# EAGLE design Mini Differential IR Endstop by DC42 (EAGLE 7.5.0)
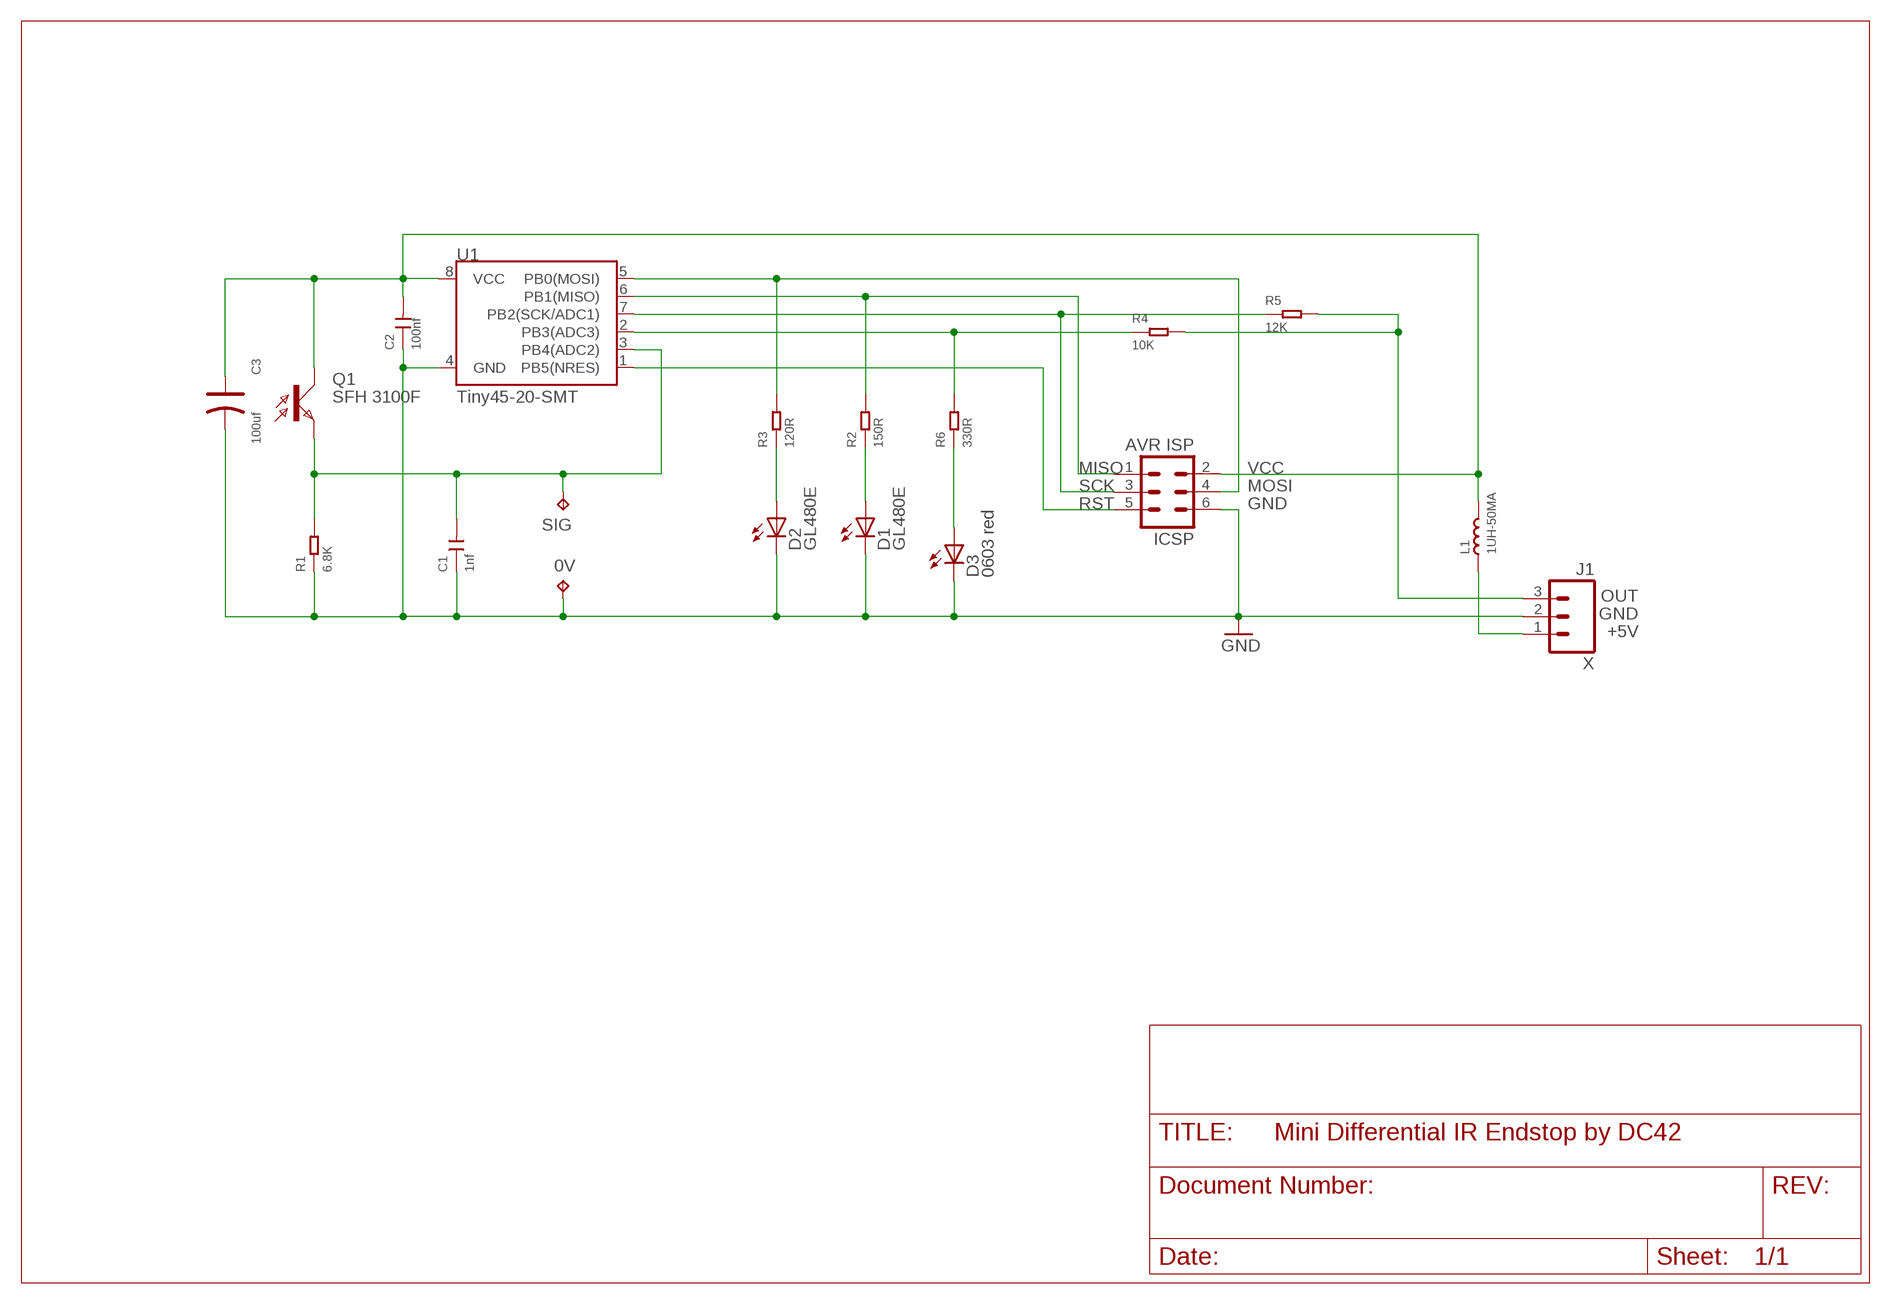
[diagram p0: schematic, sheet 1]

## Parts
0V  TPB1,27  [B1,27]
C1  1nf  CERAMIC-1NF-50V-5%-C0G(0603)  [C0603]
C2  100nf  CERAMIC-100NF-50V-10%-X7R(0603)  [C0603]
C3  100uf  DIP-ALUMINUM-100UF-16V(D5-H7MM)  [PC-D5.3MM]
D1  GL480E  LEDIRL80A  [IRL80A]
D2  GL480E  LEDIRL80A  [IRL80A]
D3  0603 red  LEDCHIP-LED0603  [CHIP-LED0603]
ICSP  AVR ISP  MA03-2  [MA03-2]
J1  X  M03LOCK  [1X03_LOCK]
L1  1UH-50MA  SMD-INDUCTOR-1UH-10%-50MA(0805)  [L0805]
Q1  SFH 3100F  SFH3100F  [SIDELOOKER]
R1  6.8K  SMD-RES-6.8K-1%-1/10W(0603)  [R0603]
R2  150R  SMD-RES-150R-1%-1/10W(0603)  [R0603]
R3  120R  SMD-RES-120R-1%-1/10W(0603)  [R0603]
R4  10K  SMD-RES-10K-1%-1/10W(0603)  [R0603]
R5  12K  SMD-RES-12K-1%-1/10W(0603)  [R0603]
R6  330R  SMD-RES-330R-1%-1/10W(0603)  [R0603]
SIG  TPB1,27  [B1,27]
U1  Tiny45-20-SMT  ATTINY45TINY45-20-SMT  [SO08-EIAJ]

## Nets
+5V: J1.1 L1.1
GND: 0V.TP C1.1 C2.1 C3.- D1.K(C) D2.K(C) D3.C ICSP.6 J1.2 R1.1 U1.4(GND)
MISO: ICSP.1 R2.2 U1.6(PB1(MISO))
MOSI: ICSP.4 R3.2 U1.5(PB0(MOSI))
N$2: R4.1 R6.2 U1.2(PB3(ADC3))
N$3: D1.A R2.1
N$5: D2.A R3.1
N$6: D3.A R6.1
N$14: C1.2 Q1.K(E) R1.2 SIG.TP U1.3(PB4(ADC2))
OUT: J1.3 R4.2 R5.2
RST: ICSP.5 U1.1(PB5(NRES))
SCK: ICSP.3 R5.1 U1.7(PB2(SCK/ADC1))
VCC: C2.2 C3.+ ICSP.2 L1.2 Q1.A(C) U1.8(VCC)

## Library data of the parts
0V SIG = testpad:TP: Test pad
C1 = Seeed-OPL-Capacitor:CERAMIC-1NF-50V-5%-C0G(0603): 302010341; MPN: GRM1885C1H102JA01D
C2 = Seeed-OPL-Capacitor:CERAMIC-100NF-50V-10%-X7R(0603): 302010138; MPN: CC0603KRX7R9BB104
C3 = Seeed-OPL-Capacitor:DIP-ALUMINUM-100UF-16V(D5-H7MM): 302030031
D1-D3 = led:LED: LED OSRAM: - CHIPLED LG R971, LG N971, LY N971, LG Q971, LY Q971, LO R971, LY R971 LH N974, LH R974 LS Q976, LO Q976, LY Q976 LO Q996 - Hyper CHIPLED LW Q18S LB Q993, LB Q99A, LB R99A - SideLED LS A670, LO A670, LY A670, LG A670, LP A670 LB A673, LV A673, LT A673, LW A673 LH A674 LY A675 LS A676, LA A676, LO A676, LY A676, LW A676 LS A679, LY A679, LG A679 - Hyper Micro SIDELED® LS Y876, LA Y876, LO Y876, LY Y876 LT Y87S - SmartLED LW L88C, LW L88S LB L89C, LB L89S, LG L890 LS L89K, LO L89K, LY L89K LS L896, LA L896, LO L896, LY L896 - TOPLED LS T670, LO T670, LY T670, LG T670, LP T670 LSG T670, LSP T670, LSY T670, LOP T670, LYG T670 LG T671, LOG T671, LSG T671 LB T673, LV T673, LT T673, LW T673 LH T674 LS T676, LA T676, LO T676, LY T676, LB T676, LH T676, LSB T676, LW T676 LB T67C, LV T67C, LT T67C, LS T67K, LO T67K, LY T67K, LW E67C LS E67B, LA E67B, LO E67B, LY E67B, LB E67C, LV E67C, LT E67C LW T67C LS T679, LY T679, LG T679 LS T770, LO T770, LY T770, LG T770, LP T770 LB T773, LV T773, LT T773, LW T773 LH T774 LS E675, LA E675, LY E675, LS T675 LS T776, LA T776, LO T776, LY T776, LB T776 LHGB T686 LT T68C, LB T68C - Hyper Mini TOPLED® LB M676 - Mini TOPLED Santana® LG M470 LS M47K, LO M47K, LY M47K Source: http://www.osram.convergy.de LUXEON: - LUMILED® LXK2-PW12-R00, LXK2-PW12-S00, LXK2-PW14-U00, LXK2-PW14-V00 LXK2-PM12-R00, LXK2-PM12-S00, LXK2-PM14-U00 LXK2-PE12-Q00, LXK2-PE12-R00, LXK2-PE12-S00, LXK2-PE14-T00, LXK2-PE14-U00 LXK2-PB12-K00, LXK2-PB12-L00, LXK2-PB12-M00, LXK2-PB14-N00, LXK2-PB14-P00, LXK2-PB14-Q00 LXK2-PR12-L00, LXK2-PR12-M00, LXK2-PR14-Q00, LXK2-PR14-R00 LXK2-PD12-Q00, LXK2-PD12-R00, LXK2-PD12-S00 LXK2-PH12-R00, LXK2-PH12-S00 LXK2-PL12-P00, LXK2-PL12-Q00, LXK2-PL12-R00 Source: www.luxeon.com KINGBRIGHT: KA-3528ASYC Source: www.kingbright.com
ICSP = con-lstb:MA03-2: PIN HEADER; OC_FARNELL: unknown; OC_NEWARK: unknown
J1 = SparkFun-Connectors:M03: Header 3 Standard 3-pin 0.1" header. Use with straight break away headers (SKU : PRT-00116), right angle break away headers (PRT-00553), swiss pins (PRT-00743), machine pins (PRT-00117), and female headers (PRT-00115). Molex polarized connector foot print use with SKU : PRT-08232 with associated crimp pins and housings.
L1 = Seeed-OPL-Inductor:SMD-INDUCTOR-1UH-10%-50MA(0805): 303010005; MPN: LQM21NN1R0K10
Q1 = osramSHF3100F:SFH3100F; MOUSER: 720-SFH3100F; OSRAM: SHF 3100F
R1 = Seeed-OPL-Resistor:SMD-RES-6.8K-1%-1/10W(0603): 301010198; MPN: RC0805JR-07220KL
R2 = Seeed-OPL-Resistor:SMD-RES-150R-1%-1/10W(0603): 301010188; MPN: RC0603FR-07150RL
R3 = Seeed-OPL-Resistor:SMD-RES-120R-1%-1/10W(0603): 301010194; MPN: RC0603FR-07120RL
R4 = Seeed-OPL-Resistor:SMD-RES-10K-1%-1/10W(0603): 301010299; MPN: RC0603FR-0710KL
R5 = Seeed-OPL-Resistor:SMD-RES-12K-1%-1/10W(0603): 301010102; MPN: RC0603FR-0712KL
R6 = Seeed-OPL-Resistor:SMD-RES-330R-1%-1/10W(0603): 301010300; MPN: RC0603FR-07330RL
U1 = SparkFun-DigitalIC:ATTINY45: Atmel 8-pin 2/4/8kB flash uC; PROD_ID: IC-08922

## Board
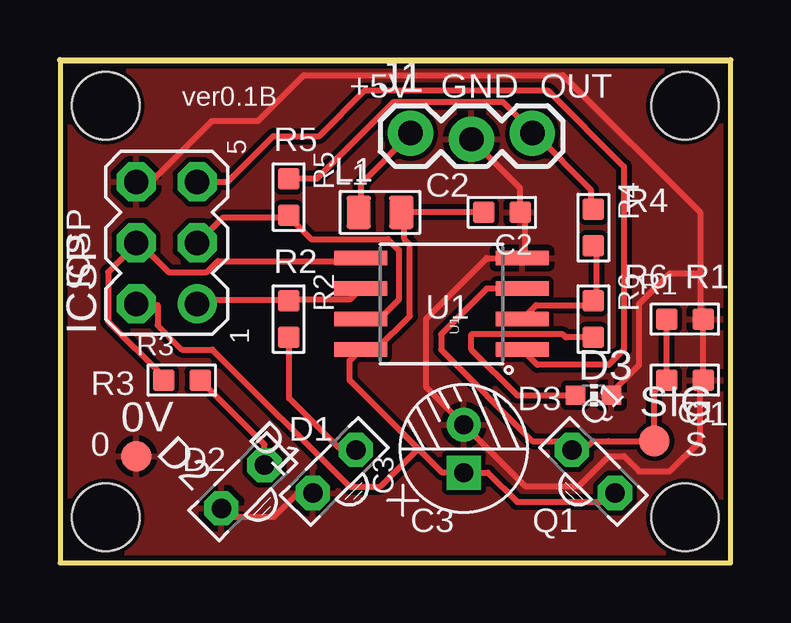
[diagram p1: board, top side]
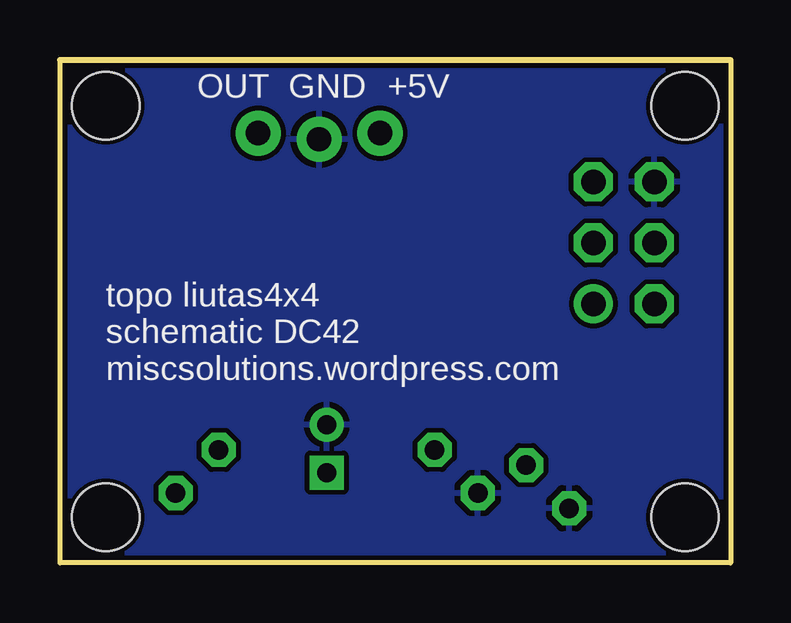
[diagram p2: board, bottom side, seen from below]

Size 27.94 x 20.96 mm. Coordinates in mm from the lower left corner, seen from the top.
Outline: 0,0 27.94,0 27.94,20.96 0,20.96 0,0
Copper layers (1*16): Top 0.035mm / dielectric 1.5mm / Bottom 0.035mm
Design rules "default": minimum track width 8mil, minimum drill 20mil, track to track 8mil, track to pad 8mil, pad to pad 8mil, via to via 8mil, smd to smd 8mil, copper to edge 8mil, drill to drill 8mil, minimum pad ring 12mil, minimum via ring 10mil, stop-mask expansion 4mil, vias tented up to drill 20mil, thermal gap 10mil
Holes 2.8 mm at 1.91,19.05 26.04,19.05 26.04,1.91 1.91,1.91

### Footprints (pad centres in the part's own frame; a part is rotated, then mirrored left to right if it is on the bottom)
B1,27 = smd 1.27 x 1.27: TP 0,0
C0603 = smd 0.889 x 0.889: 1 0,0.762; 2 0,-0.762
PC-D5.3MM = drill 0.8 pad 1.35 square: + -1,0 | drill 0.8 pad 1.35: - 1,0
IRL80A = drill 0.813 octagon: A 0,-1.27; K 0,1.27
CHIP-LED0603 = smd 0.8 x 0.8: A 0,-0.75; C 0,0.75
MA03-2 = drill 1.016: 1 -2.54,-1.27 | drill 1.016 octagon: 2 -2.54,1.27; 3 0,-1.27; 4 0,1.27; 5 2.54,-1.27; 6 2.54,1.27
1X03_LOCK = drill 1.016 pad 1.88: 1 0,0.127; 2 2.54,-0.127; 3 5.08,0.127
L0805 = smd 1.016 x 1.397: 1 -0.889,0; 2 0.889,0
SIDELOOKER = drill 0.813 octagon: A 0,-1.27; K 0,1.27
R0603 = smd 0.889 x 0.889: 1 0,0.762; 2 0,-0.762
SO08-EIAJ = smd 0.61 x 2.21: 1 -1.905,-3.378; 2 -0.635,-3.378; 3 0.635,-3.378; 4 1.905,-3.378; 5 1.905,3.353; 6 0.635,3.353; 7 -0.635,3.353; 8 -1.905,3.353

### Placement (x,y rotation side)
0V  3.17,4.45 0 top
C1  26.04,7.62 270 top
C2  18.41,14.61 270 top
C3  16.83,4.76 90 top
D1  11.43,3.81 135 top
D2  7.62,3.17 135 top
D3  22.23,6.98 270 top
ICSP  4.45,13.33 90 top
J1  14.61,17.78 0 top
L1  13.34,14.61 0 top
Q1  22.23,3.81 45 top
R1  26.04,10.16 270 top
R2  9.53,10.16 180 top
R3  5.08,7.62 270 top
R4  22.23,13.97 180 top
R5  9.53,15.24 180 top
R6  22.23,10.16 180 top
SIG  24.77,5.08 0 top
U1  15.88,10.79 90 top

### Tracks (layer width: path | path; a pad name or v marks a point on that pad's centre or on a via)
+5V
  Top 0.254: L1.1 12.52,14.63 12.52,15.77 14.58,17.83 J1.1
GND
  Top 0.254: J1.2 19.18,15.62 C2.1 19.38,14.4 19.38,12.8 U1.4 19.15,12.57 18.47,12.57 18.34,12.7 17.78,12.7 15.24,10.16 15.24,7.35 C3.- 19.41,3.17 21.59,3.17 22.86,4.45 23.5,4.45 24.13,3.81 25.4,3.81 26.67,5.08 26.67,7.49 C1.1 R1.1 26.67,10.29 26.67,12.06 | D3.C 22.98,7.1 24.13,8.26 24.13,10.79 25.4,12.06 26.67,12.06 | ICSP.6 3.81,15.88 6.35,18.42 8.26,18.42 10.16,20.32 20.95,20.32 26.67,14.61 26.67,12.06 | D1.K 9.9,2.91 8.89,1.91 7.09,1.91 D2.K
  pour Top: 0,0 0,20.96 27.94,20.96 27.94,0
  pour Bottom: 0,0 0,20.96 27.94,20.96 27.94,0
MISO
  Top 0.254: U1.6 12.06,10.97 9.55,10.97 R2.2 9.32,10.97 5.89,10.97 ICSP.1
MOSI
  Top 0.254: R3.2 4.29,7.77 2.01,10.06 2.01,12.12 3.15,13.26 ICSP.4 3.38,13.26 4.52,12.12 6.12,12.12 6.58,12.57 12.52,12.57 U1.5
N$2
  Top 0.254: R4.1 22.35,13.03 22.35,10.97 R6.2 22.12,10.74 19.84,10.74 U1.2
N$3
  Top 0.254: R2.1 9.55,9.37 9.55,6.86 11.61,4.8 D1.A
N$5
  Top 0.254: 5.89,7.54 R3.1 8.52,4.94 D2.A
N$6
  Top 0.254: R6.1 21.08,9.4 20.95,9.53 17.14,9.53 17.14,8.89 19.05,6.98 D3.A
N$14
  Top 0.254: Q1.K 21.85,4.71 22.23,5.08 22.86,5.08 SIG.TP 24.77,7.11 C1.2 R1.2 | Q1.K | U1.3 17.78,11.43 15.88,9.53 15.88,8.89 19.68,5.08 20.95,5.08 Q1.K
OUT
  Top 0.254: 22.35,14.86 R4.2 22.12,14.86 22.12,15.54 19.84,17.83 J1.3 19.61,18.06 18.47,19.2 13.89,19.2 10.69,16 R5.2
RST
  Top 0.254: ICSP.5 6.99,15.88 8.89,17.78 10.79,17.78 12.7,19.69 20.32,19.69 23.5,16.51 23.5,8.89 22.86,8.26 19.89,8.26 U1.1
SCK
  Top 0.254: 13.44,10.29 12.52,10.29 U1.7 13.44,10.29 | ICSP.3 5.89,13.49 6.81,14.4 9.32,14.4 R5.1 9.55,14.4 10.46,13.49 13.66,13.49 14.12,13.03 14.12,10.97 13.44,10.29
VCC
  Top 0.254: C2.2 17.55,14.63 14.35,14.63 L1.2 14.35,14.4 14.35,13.49 14.58,13.26 14.58,10.29 13.21,8.91 12.52,8.91 U1.8 12.06,8.43 12.06,7.62 14.92,4.76 | ICSP.2 3.38,10.74 4.06,10.74 4.06,9.91 5.08,8.89 6.35,8.89 12.06,3.17 13.34,3.17 14.92,4.76 | Q1.A 22.75,2.54 19.05,2.54 17.83,3.76 C3.+ 15.92,3.76 14.92,4.76

### Text on the board
tPlace: +5V | GND | OUT | ver0.1B | R5 | L1 | C2 | R4 | ICSP | R2 | R6 | R1 | U1 | R3 | D3 | C1 | 0 | D1 | S | D2 | C3 | Q1
bPlace: +5V | GND | OUT | topo liutas4x4 / schematic DC42 / miscsolutions.wordpress.com